# Altium schematic sheet CAN.SchDoc: CAN Bus
size A4; Organization: ENEL429 Group N; Address1: ECE Department; Address2: University of Canterbury; Address3: Christchurch 8041; Address4: New Zealand; Revision: 1
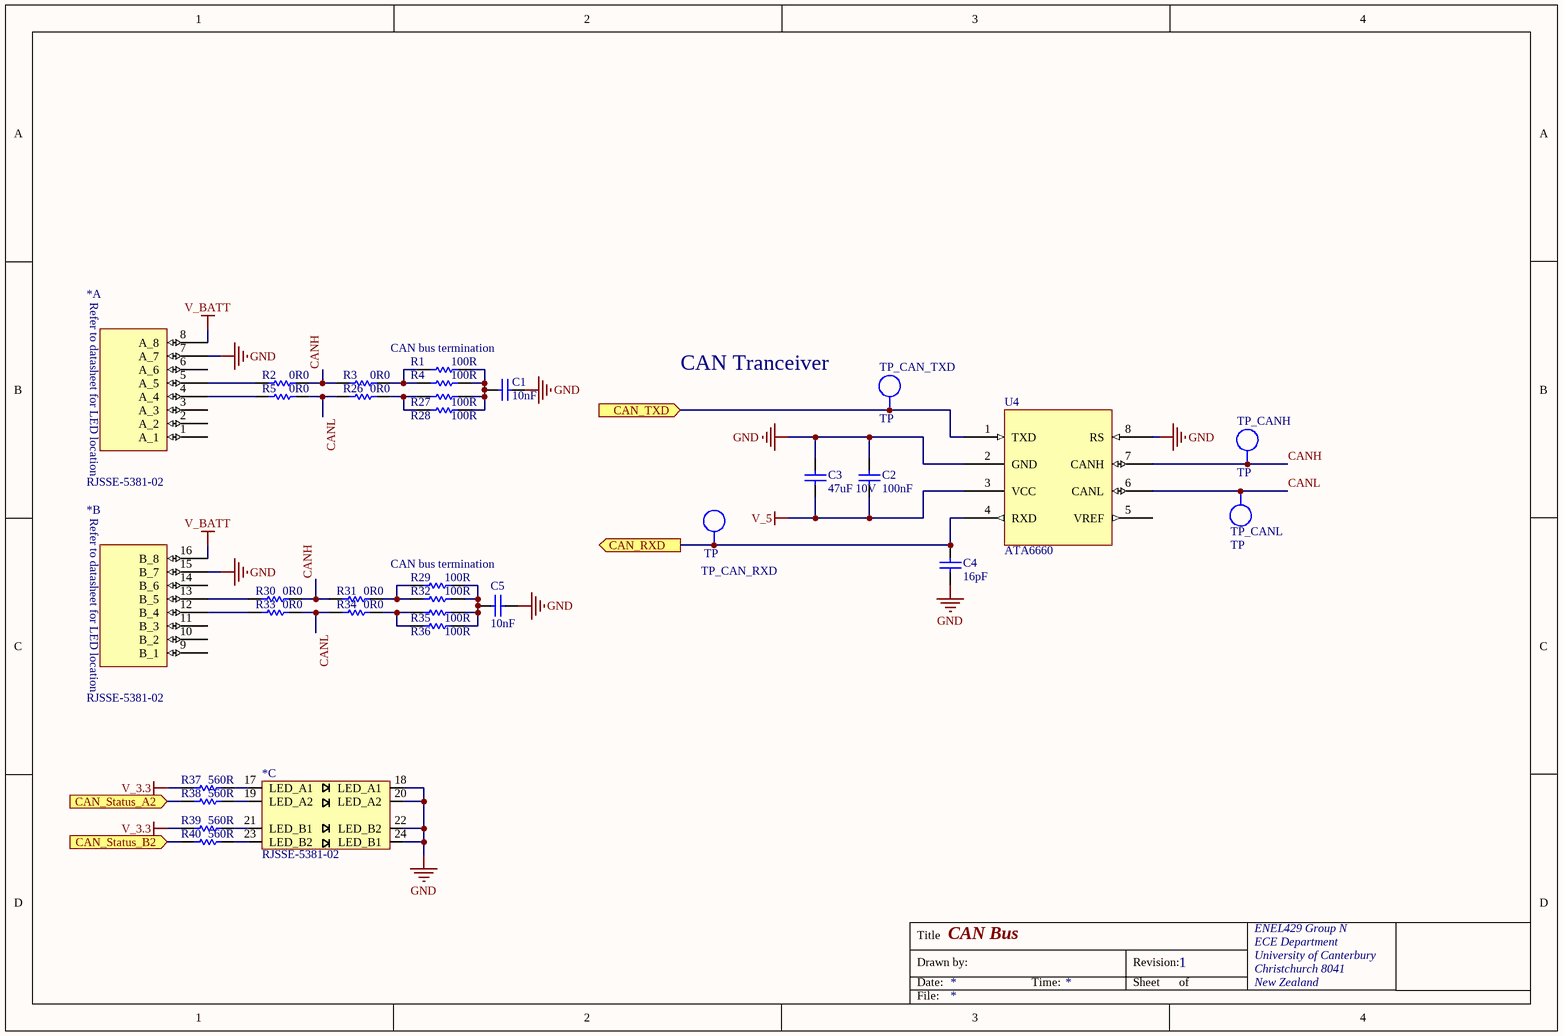
[diagram p0: CAN.SchDoc]

## Parts
(Parts that share a designator on the sheet are numbered #1, #2 ... from top to bottom, then left to right.)
*#1  RJSSE-5381-02  [RJSSE-5381-02]  (part A of 3)
*#2  RJSSE-5381-02  [RJSSE-5381-02]  (part B of 3)
*#3  RJSSE-5381-02  [RJSSE-5381-02]  (part C of 3)
C1  10nF  [0603]
C2  100nF  [0603]
C3  47uF 10V  [1210]
C4  16pF  [0603]
C5  10nF  [0603]
R1  100R  [0603]
R2  0R0  [0603]  (no BOM)
R3  0R0  [0603]  (no BOM)
R4  100R  [0603]
R5  0R0  [0603]  (no BOM)
R26  0R0  [0603]  (no BOM)
R27  100R  [0603]
R28  100R  [0603]
R29  100R  [0603]
R30  0R0  [0603]  (no BOM)
R31  0R0  [0603]  (no BOM)
R32  100R  [0603]
R33  0R0  [0603]  (no BOM)
R34  0R0  [0603]  (no BOM)
R35  100R  [0603]
R36  100R  [0603]
R37  560R  [0603]
R38  560R  [0603]
R39  560R  [0603]
R40  560R  [0603]
TP_CAN_RXD  TP  [TEST_POINT_4X2MM]  (no BOM)
TP_CAN_TXD  TP  [TEST_POINT_4X2MM]  (no BOM)
TP_CANH  TP  [TEST_POINT_4X2MM]  (no BOM)
TP_CANL  TP  [TEST_POINT_4X2MM]  (no BOM)
U4  ATA6660  [SOIC127P600X150-8N]

## Ports
CAN_RXD (out), CAN_Status_A2 (in), CAN_Status_B2 (in), CAN_TXD (in)

## Nets
GND: *#1.7(A_7) *#2.15(B_7) *#3.18(LED_A1) *#3.20(LED_A2) *#3.22(LED_B2) *#3.24(LED_B1) C1.1 C2.2 C3.2 C4.1 C5.1 U4.2(GND) U4.8(RS)
V_3.3: R37.1 R39.1
V_5: C2.1 C3.1 U4.3(VCC)
V_BATT: *#1.8(A_8) *#2.16(B_8)
CAN_RXD: C4.2 TP_CAN_RXD.1 U4.4(RXD) ; port CAN_RXD
CAN_Status_A2: R38.1 ; port CAN_Status_A2
CAN_Status_B2: R40.1 ; port CAN_Status_B2
CAN_TXD: TP_CAN_TXD.1 U4.1(TXD) ; port CAN_TXD
CANH: R2.2 R3.1 R30.2 R31.1 TP_CANH.1 U4.7(CANH)
CANL: R5.2 R26.1 R33.2 R34.1 TP_CANL.1 U4.6(CANL)
Net*#1_4: *#1.4(A_4) R5.1
Net*#1_5: *#1.5(A_5) R2.1
Net*#2_12: *#2.12(B_4) R33.1
Net*#2_13: *#2.13(B_5) R30.1
Net*#3_17: *#3.17(LED_A1) R37.2
Net*#3_19: *#3.19(LED_A2) R38.2
Net*#3_21: *#3.21(LED_B1) R39.2
Net*#3_23: *#3.23(LED_B2) R40.2
NetC1_2: C1.2 R1.2 R4.2 R27.2 R28.2
NetC5_2: C5.2 R29.2 R32.2 R35.2 R36.2
NetR1_1: R1.1 R3.2 R4.1
NetR26_2: R26.2 R27.1 R28.1
NetR29_1: R29.1 R31.2 R32.1
NetR34_2: R34.2 R35.1 R36.1

Not connected (* = marked no-connect by the designer): *#1 1(A_1) 2(A_2) 3(A_3) 6(A_6); *#2 9(B_1) 10(B_2) 11(B_3) 14(B_6); U4 5(VREF)

## Notes on the sheet
- (near R1) CAN bus termination
- CAN Tranceiver
- (near R29) CAN bus termination
- Title
- Drawn by:
- Date:
- Time:
- Revision:
- Sheet
- of
- File:
- (in symbol RJSSE-5381-02, part A) Refer to datasheet for LED location
- (in symbol RJSSE-5381-02, part B) Refer to datasheet for LED location

## Library data of the parts
*#1-*#3 = RJSSE-5381-02: RJ45 SMT Right Angle x2; Manufacturer: Amphenol Commercial Products; Manufacturer Part Number: RJSSE-5381-02; Supplier 1: Digikey; Supplier Part Number 1: RJSSE-5381-02-ND
C1 C5 = CP_10nF 0603: CAP CER 10000PF 100V X7R 0603; Manufacturer: Taiyo Yuden; Manufacturer PN: HMK107B7103KA-T; Value: 10nF; Part Number: CP_10nF 0603; Component Kind: Standard; Component Type: Standard; Designator: CP_10nF 0603; Pin Count: 2; Supplier 1: Digi-Key; Supplier Part Number 1: 587-1446-2-ND; Signal Integrity: Cap; Simulation: CAP
C2 = CP_100nF 0603: CAP CER .10UF 50V X5R 0603; Manufacturer: Taiyo Yuden; Manufacturer PN: UMK107B7104KA-T; Value: 100nF; Part Number: CP_100nF 0603; Component Kind: Standard; Component Type: Standard; Designator: CP_100nF 0603; Pin Count: 2; LatestRevisionDate: 29 May 08; Supplier 1: Digi-Key; Supplier Part Number 1: 478-6206-1-ND; Signal Integrity: Cap; Simulation: CAP
C3 = CP_47uF 10V 1210: CAP CER 47uF 10V X5R 1210; Manufacturer: Murata; Manufacturer PN: GRM32ER61A476KE20L; Value: 47uF 10V; Part Number: CP_47uF 10V 1210; Component Kind: Standard; Component Type: Standard; Designator: CP_47uF 10V 1210; Pin Count: 2; LatestRevisionDate: 29 May 08; Supplier 1: Digi-Key; Supplier Part Number 1: 490-3887-1-ND
C4 = CP_16pF_100V_0603: CAP CER 16PF 100V 5% C0G 0603; Manufacturer: Murata; Manufacturer PN: GRM1885C2A160JA01D; Value: 16pF; Part Number: CP_16pF_100V_0603; Component Kind: Standard; Component Type: Standard; Designator: CP_16pF_100V_0603; Pin Count: 2; Supplier 1: Digi-Key; Supplier Part Number 1: 490-1332-1-ND; Signal Integrity: Cap; Simulation: CAP
R1 R4 R27-R29 R32 R35 R36 = RS_100R 0603: RES 100 OHM 1/10W 1% 0603 SMD; Manufacturer: ROHM; Manufacturer PN: MCR03EZPFX1000; LatestRevisionDate: n/a; Supplier 1: Digi-Key; Supplier Part Number 1: RHM100HTR-ND; Value: 100R; Part Number: RS_100R 0603; Component Kind: Standard; Component Type: Standard; Designator: RS_100R 0603; Pin Count: 2; Signal Integrity: Res; Simulation: RESISTOR
R2 R3 R5 R26 R30 R31 R33 R34 = RS_0R0 0603: RES 0.0 OHM 1/10W 5% 0603 SMD; Manufacturer: Rohm; Manufacturer PN: MCR03EZPJ000; LatestRevisionDate: 3 Jun 08; Supplier 1: Digi-Key; Supplier Part Number 1: RHM0.0GTR-ND; Value: 0R0; Part Number: RS_0R0 0603; Component Type: Standard (No BOM); Designator: RS_0R0 0603; Pin Count: 2; Signal Integrity: Res; Simulation: RESISTOR
R37-R40 = RS_560R 0603: RES 560 OHM 1/10W 1% 0603 SMD; Manufacturer: Yageo; Manufacturer PN: RC0603FR-07560RL; Value: 560R; Part Number: RS_560R 0603; Component Kind: Standard; Component Type: Standard; Designator: RS_560R 0603; Pin Count: 2; LatestRevisionDate: 6 May 2011; Supplier 1: Digi-Key; Supplier Part Number 1: 311-560GRTR-ND; Signal Integrity: Res; Simulation: RESISTOR
TP_CAN_RXD TP_CAN_TXD TP_CANH TP_CANL = TP_TESTPOINT: Test-Point; LatestRevisionDate: 29 May 08; Manufacturer PN: *; Manufacturer: *; Supplier 1: Digi-Key; Supplier Part Number 1: 5016KTR-ND; Value: TP; Part Number: TP_TESTPOINT; Component Type: Standard (No BOM); Designator: TP_TESTPOINT; Pin Count: 1
U4 = ATA6660: Manufacturer: Atmel; Manufacturer Part Number: ATA6660-TAPY-19; Supplier 1: Mouser; Supplier Part Number 1: 556-ATA6660TAPY